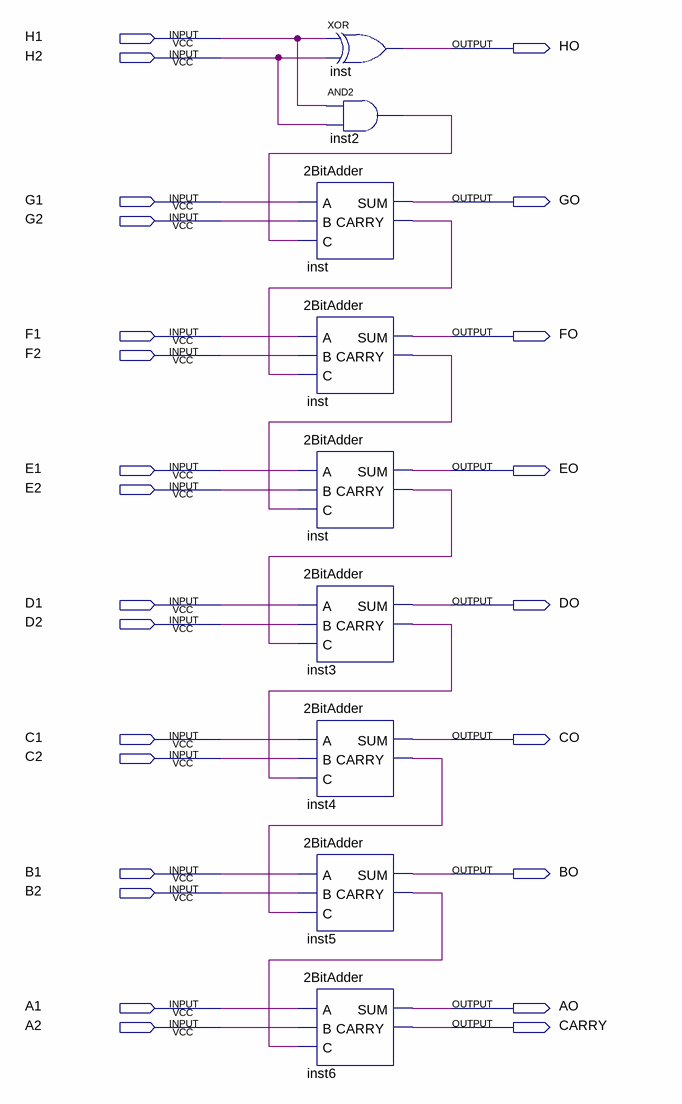
[diagram p0: schematic sheet]
// Quartus schematic Adder.bdf as structural Verilog: 9 symbols, 25 pins
module Adder (
  input  H1,
  input  H2,
  input  G1,
  input  G2,
  input  F1,
  input  F2,
  input  E1,
  input  E2,
  input  D1,
  input  D2,
  input  C1,
  input  C2,
  input  B1,
  input  B2,
  input  A1,
  input  A2,
  output HO,
  output GO,
  output FO,
  output EO,
  output DO,
  output CO,
  output BO,
  output AO,
  output CARRY
);

  wire inst2_out, inst3_carry, inst4_carry, inst5_carry, inst_carry, inst_carry_2, inst_carry_3;

  \2BitAdder  inst (.A(G1), .B(G2), .C(inst2_out), .SUM(GO), .CARRY(inst_carry));
  \2BitAdder  inst_dup2 (.A(F1), .B(F2), .C(inst_carry), .SUM(FO), .CARRY(inst_carry_2));
  \2BitAdder  inst_dup3 (.A(E1), .B(E2), .C(inst_carry_2), .SUM(EO), .CARRY(inst_carry_3));
  \2BitAdder  inst3 (.A(D1), .B(D2), .C(inst_carry_3), .SUM(DO), .CARRY(inst3_carry));
  \2BitAdder  inst4 (.A(C1), .B(C2), .C(inst3_carry), .SUM(CO), .CARRY(inst4_carry));
  \2BitAdder  inst5 (.A(B1), .B(B2), .C(inst4_carry), .SUM(BO), .CARRY(inst5_carry));
  \2BitAdder  inst6 (.A(A1), .B(A2), .C(inst5_carry), .SUM(AO), .CARRY(CARRY));
  xor inst_dup4 (HO, H1, H2);
  and inst2 (inst2_out, H1, H2);
endmodule
